# EAGLE design stm_board (EAGLE 9.3.1)
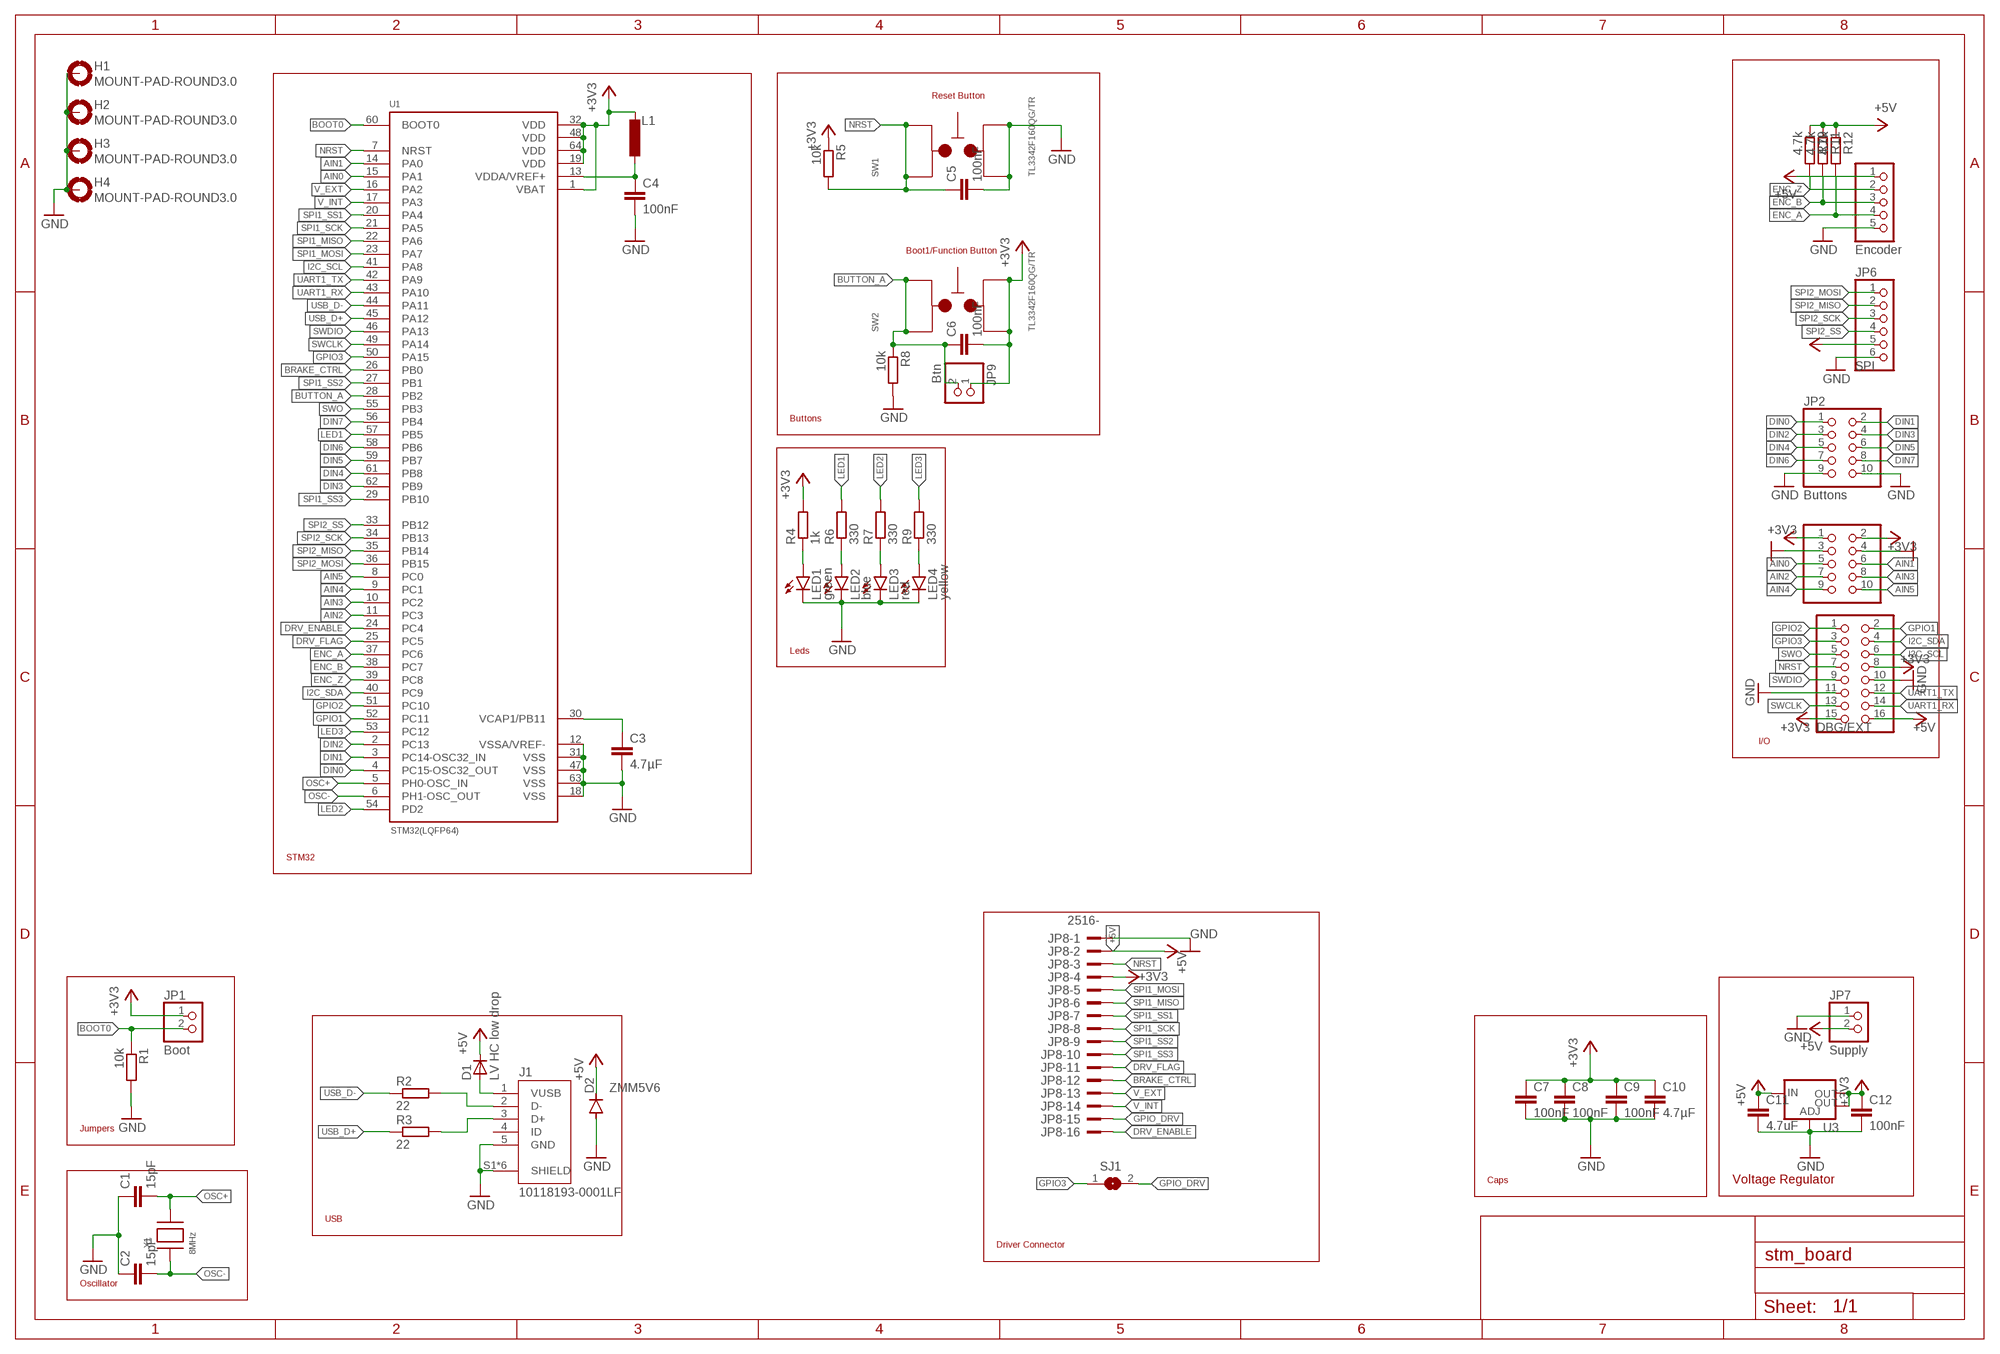
[diagram p0: schematic, sheet 1]

## Parts
C1  15pF  C-EUC0603  [C0603]
C2  15pF  C-EUC0603  [C0603]
C3  4.7µF  C-EUC0805  [C0805]
C4  100nF  C-EUC0603  [C0603]
C5  100nF  C-EUC0603  [C0603]
C6  100nF  C-EUC0603  [C0603]
C7  100nF  C-EUC0603  [C0603]
C8  100nF  C-EUC0603  [C0603]
C9  100nF  C-EUC0603  [C0603]
C10  4.7µF  C-EUC0805  [C0805]
C11  4.7uF  C-EUC0805  [C0805]
C12  100nF  C-EUC0603  [C0603]
D1  LV HC low drop  DIODESMA  [SMADIODE]
D2  ZMM5V6  DIODE-MINIMELF  [MINIMELF]
H1  MOUNT-PAD-ROUND3.0  [3,0-PAD]
H2  MOUNT-PAD-ROUND3.0  [3,0-PAD]
H3  MOUNT-PAD-ROUND3.0  [3,0-PAD]
H4  MOUNT-PAD-ROUND3.0  [3,0-PAD]
J1  10118193-0001LF  [FCI_10118193-0001LF]
JP1  Boot  PINHD-1X2  [1X02]
JP2  Buttons  PINHD-2X5  [2X05]
JP3  Analog  PINHD-2X5  [2X05]
JP4  DBG/EXT  PINHD-2X8  [2X08]
JP5  Encoder  PINHD-1X5  [1X05]
JP6  SPI  PINHD-1X6  [1X06]
JP7  Supply  PINHD-1X2  [1X02]
JP8  2516-  [PAK100/2500-16]
JP9  Btn  PINHD-1X2  [1X02]
L1  2.2µH  L-EUL2012C  [L2012C]
LED1  green  LEDCHIPLED_0805  [CHIPLED_0805]
LED2  blue  LEDCHIPLED_0805  [CHIPLED_0805]
LED3  red  LEDCHIPLED_0805  [CHIPLED_0805]
LED4  yellow  LEDCHIPLED_0805  [CHIPLED_0805]
R1  10k  R-EU_R0603  [R0603]
R2  22  R-EU_R0603  [R0603]
R3  22  R-EU_R0603  [R0603]
R4  1k  R-EU_R0603  [R0603]
R5  10k  R-EU_R0603  [R0603]
R6  330  R-EU_R0603  [R0603]
R7  330  R-EU_R0603  [R0603]
R8  10k  R-EU_R0603  [R0603]
R9  330  R-EU_R0603  [R0603]
R10  4.7k  R-EU_R0603  [R0603]
R11  4.7k  R-EU_R0603  [R0603]
R12  4.7k  R-EU_R0603  [R0603]
SJ1  SJ  [SJ]
SW1  TL3342F160QG/TR  [TL3342F160QG/TR]
SW2  TL3342F160QG/TR  [TL3342F160QG/TR]
U1  STM32(LQFP64)  [QFP50P1200X1200X160-64N]
U3  V_REG_LM1117SOT223  [SOT223]
X1  8MHz  XTALNX5032  [NX5032]

## Nets
+3V3: C6.2 C7.1 C8.1 C9.1 C10.1 C12.1 JP1.1 JP3.1 JP3.2 JP4.8 JP4.15 JP6.5 JP8.4 JP9.1 L1.1 R4.2 R5.1 SW2.1 SW2.2 U1.1(VBAT) U1.19(VDD) U1.32(VDD) U1.48(VDD) U1.64(VDD) U3.2(OUT) U3.4(OUT)
+5V: C11.1 D1.C D2.C JP4.16 JP5.1 JP7.2 JP8.2 R10.1 R11.1 R12.1 U3.3(IN)
AIN0: JP3.5 U1.15(PA1)
AIN1: JP3.6 U1.14(PA0)
AIN2: JP3.7 U1.11(PC3)
AIN3: JP3.8 U1.10(PC2)
AIN4: JP3.9 U1.9(PC1)
AIN5: JP3.10 U1.8(PC0)
BOOT0: JP1.2 R1.1 U1.60(BOOT0)
BRAKE_CTRL: JP8.12 U1.26(PB0)
BUTTON_A: C6.1 JP9.2 R8.1 SW2.3 SW2.4 U1.28(PB2)
DIN0: JP2.1 U1.4(PC15-OSC32_OUT)
DIN1: JP2.2 U1.3(PC14-OSC32_IN)
DIN2: JP2.3 U1.2(PC13)
DIN3: JP2.4 U1.62(PB9)
DIN4: JP2.5 U1.61(PB8)
DIN5: JP2.6 U1.59(PB7)
DIN6: JP2.7 U1.58(PB6)
DIN7: JP2.8 U1.56(PB4)
DRV_ENABLE: JP8.16 U1.24(PC4)
DRV_FLAG: JP8.11 U1.25(PC5)
ENC_A: JP5.4 R12.2 U1.37(PC6)
ENC_B: JP5.3 R11.2 U1.38(PC7)
ENC_Z: JP5.2 R10.2 U1.39(PC8)
GND: C1.1 C2.1 C3.2 C4.2 C5.2 C7.2 C8.2 C9.2 C10.2 C11.2 C12.2 D2.A H1.B3,0(MOUNT) H2.B3,0(MOUNT) H3.B3,0(MOUNT) H4.B3,0(MOUNT) J1.5(GND) J1.S1(SHIELD) J1.S2(SHIELD) J1.S3(SHIELD) J1.S4(SHIELD) J1.S5(SHIELD) J1.S6(SHIELD) JP2.9 JP2.10 JP3.3 JP3.4 JP4.10 JP4.11 JP5.5 JP6.6 JP7.1 JP8.1 LED1.C LED2.C LED3.C LED4.C R1.2 R8.2 SW1.1 SW1.2 U1.12(VSSA/VREF-) U1.18(VSS) U1.31(VSS) U1.47(VSS) U1.63(VSS) U3.1(ADJ)
GPIO1: JP4.2 U1.52(PC11)
GPIO2: JP4.1 U1.51(PC10)
GPIO3: JP4.3 SJ1.1 U1.50(PA15)
GPIO_DRV: JP8.15 SJ1.2
I2C_SCL: JP4.6 U1.41(PA8)
I2C_SDA: JP4.4 U1.40(PC9)
LED1: R6.2 U1.57(PB5)
LED2: R7.2 U1.54(PD2)
LED3: R9.2 U1.53(PC12)
N$1: D1.A J1.1(VUSB)
N$2: LED4.A R9.1
N$3: C4.1 L1.2 U1.13(VDDA/VREF+)
N$4: C3.1 U1.30(VCAP1/PB11)
N$5: J1.2(D-) R2.2
N$6: J1.3(D+) R3.2
N$11: LED1.A R4.1
N$12: LED2.A R6.1
N$13: LED3.A R7.1
NRST: C5.1 JP4.7 JP8.3 R5.2 SW1.3 SW1.4 U1.7(NRST)
OSC+: C1.2 U1.5(PH0-OSC_IN) X1.P$2
OSC-: C2.2 U1.6(PH1-OSC_OUT) X1.P$1
SPI1_MISO: JP8.6 U1.22(PA6)
SPI1_MOSI: JP8.5 U1.23(PA7)
SPI1_SCK: JP8.8 U1.21(PA5)
SPI1_SS1: JP8.7 U1.20(PA4)
SPI1_SS2: JP8.9 U1.27(PB1)
SPI1_SS3: JP8.10 U1.29(PB10)
SPI2_MISO: JP6.2 U1.35(PB14)
SPI2_MOSI: JP6.1 U1.36(PB15)
SPI2_SCK: JP6.3 U1.34(PB13)
SPI2_SS: JP6.4 U1.33(PB12)
SWCLK: JP4.13 U1.49(PA14)
SWDIO: JP4.9 U1.46(PA13)
SWO: JP4.5 U1.55(PB3)
UART1_RX: JP4.14 U1.43(PA10)
UART1_TX: JP4.12 U1.42(PA9)
USB_D+: R3.1 U1.45(PA12)
USB_D-: R2.1 U1.44(PA11)
V_EXT: JP8.13 U1.16(PA2)
V_INT: JP8.14 U1.17(PA3)
Unconnected: J1.4(ID)

## Notes on the sheet
- Reset Button
- Boot1/Function Button
- Buttons
- Leds
- I/O
- STM32
- Jumpers
- Caps | Voltage Regulator
- USB
- Driver Connector
- Oscillator

## Library data of the parts
C1-C12 = resistor:C-EU: CAPACITOR, European symbol
D1 = adafruit:DIODE: Diode SMADIODE - SMA Surface Mount Package 20V 1A Schottky Diode Digikey: 641-1014-6-ND DO-1N4148 - Through Hole Small Current Diode SOD-123 20V 1 A (.5mV Vf) Schottky Diode - Digikey: MBRX120TPMSCT-ND SOD-323 10V 570mA (.38mV Vf, 3ns) Schottky Diode - Digikey: ZLLS410CT-ND SOD-523 30V 30mA Schottky Diode (RB751S-40TE61) - Digikey: RB751S-40TE61CT-ND SOT23-R/W - SOT23 Package (R = Solder Paste/Reflow Ovens, W = Hand-Soldering) BAT54Film 40V 300mA - Digikey: 497-7162-1-ND
D2 = diode:DIODE-: DIODE
H1-H4 = holes:MOUNT-PAD-ROUND: MOUNTING PAD, round
J1 = con_ampusb_10118193-0001LF:10118193-0001LF: Micro USB B Type Receptacle; AVAILABILITY: Unavailable; DESCRIPTION: Single Port 5 Contact Shielded SMT MICRO USB B-Type Receptacle; MF: Amphenol ICC; MP: 10118193-0001LF; PACKAGE: None; PRICE: None
JP1 JP7 JP9 = pinhead:PINHD-1X2: PIN HEADER
JP2 JP3 = pinhead:PINHD-2X5: PIN HEADER
JP4 = pinhead:PINHD-2X8: PIN HEADER
JP5 = pinhead:PINHD-1X5: PIN HEADER
JP6 = pinhead:PINHD-1X6: PIN HEADER
JP8 = con-3m:2516-: 3M (TM) Pak 100 4-Wall Header Source: 3M; OC_FARNELL: unknown; OC_NEWARK: unknown
L1 = resistor:L-EU: INDUCTOR, European symbol
LED1-LED4 = led:LED: LED OSRAM: - CHIPLED LG R971, LG N971, LY N971, LG Q971, LY Q971, LO R971, LY R971 LH N974, LH R974 LS Q976, LO Q976, LY Q976 LO Q996 - Hyper CHIPLED LW Q18S LB Q993, LB Q99A, LB R99A - SideLED LS A670, LO A670, LY A670, LG A670, LP A670 LB A673, LV A673, LT A673, LW A673 LH A674 LY A675 LS A676, LA A676, LO A676, LY A676, LW A676 LS A679, LY A679, LG A679 - Hyper Micro SIDELED® LS Y876, LA Y876, LO Y876, LY Y876 LT Y87S - SmartLED LW L88C, LW L88S LB L89C, LB L89S, LG L890 LS L89K, LO L89K, LY L89K LS L896, LA L896, LO L896, LY L896 - TOPLED LS T670, LO T670, LY T670, LG T670, LP T670 LSG T670, LSP T670, LSY T670, LOP T670, LYG T670 LG T671, LOG T671, LSG T671 LB T673, LV T673, LT T673, LW T673 LH T674 LS T676, LA T676, LO T676, LY T676, LB T676, LH T676, LSB T676, LW T676 LB T67C, LV T67C, LT T67C, LS T67K, LO T67K, LY T67K, LW E67C LS E67B, LA E67B, LO E67B, LY E67B, LB E67C, LV E67C, LT E67C LW T67C LS T679, LY T679, LG T679 LS T770, LO T770, LY T770, LG T770, LP T770 LB T773, LV T773, LT T773, LW T773 LH T774 LS E675, LA E675, LY E675, LS T675 LS T776, LA T776, LO T776, LY T776, LB T776 LHGB T686 LT T68C, LB T68C - Hyper Mini TOPLED® LB M676 - Mini TOPLED Santana® LG M470 LS M47K, LO M47K, LY M47K Source: http://www.osram.convergy.de LUXEON: - LUMILED® LXK2-PW12-R00, LXK2-PW12-S00, LXK2-PW14-U00, LXK2-PW14-V00 LXK2-PM12-R00, LXK2-PM12-S00, LXK2-PM14-U00 LXK2-PE12-Q00, LXK2-PE12-R00, LXK2-PE12-S00, LXK2-PE14-T00, LXK2-PE14-U00 LXK2-PB12-K00, LXK2-PB12-L00, LXK2-PB12-M00, LXK2-PB14-N00, LXK2-PB14-P00, LXK2-PB14-Q00 LXK2-PR12-L00, LXK2-PR12-M00, LXK2-PR14-Q00, LXK2-PR14-R00 LXK2-PD12-Q00, LXK2-PD12-R00, LXK2-PD12-S00 LXK2-PH12-R00, LXK2-PH12-S00 LXK2-PL12-P00, LXK2-PL12-Q00, LXK2-PL12-R00 Source: www.luxeon.com KINGBRIGHT: KA-3528ASYC Source: www.kingbright.com
R1-R12 = resistor:R-EU_: RESISTOR, European symbol
SJ1 = jumper:SJ: SMD solder JUMPER
SW1 SW2 = Switch:TL3342F160QG/TR: SWITCH TACTILE SPST-NO 0.05A 12V Manufacturer's datasheet <http://spec_sheets.e-switch.com/specs/P010632.pdf>; CREATED_BY: PCBLayout.com; DIGI_KEY_PART_NUMBER: EG2531CT-ND; MANUFACTURER: E-Switch; MPN: TL3342F160QG/TR; PACKAGE: SPST_NO
U1 = STM32F411RET6:STM32(LQFP64); AVAILABILITY: Unavailable; MF: STMicroelectronics; MP: STM32; PACKAGE: LQFP-64 STMicroelectronics; PRICE: None
U3 = SparkFun-IC-Power:V_REG_LM1117: Voltage Regulator LM1117 Standard adjustable voltage regulator but in SMD form. Spark Fun Electronics SKU : COM-00595; PROD_ID: VREG-08170
X1 = adafruit:XTAL: Low cost SMT crystals, no capacitors included http://www.ladyada.net/library/eagle

## Board
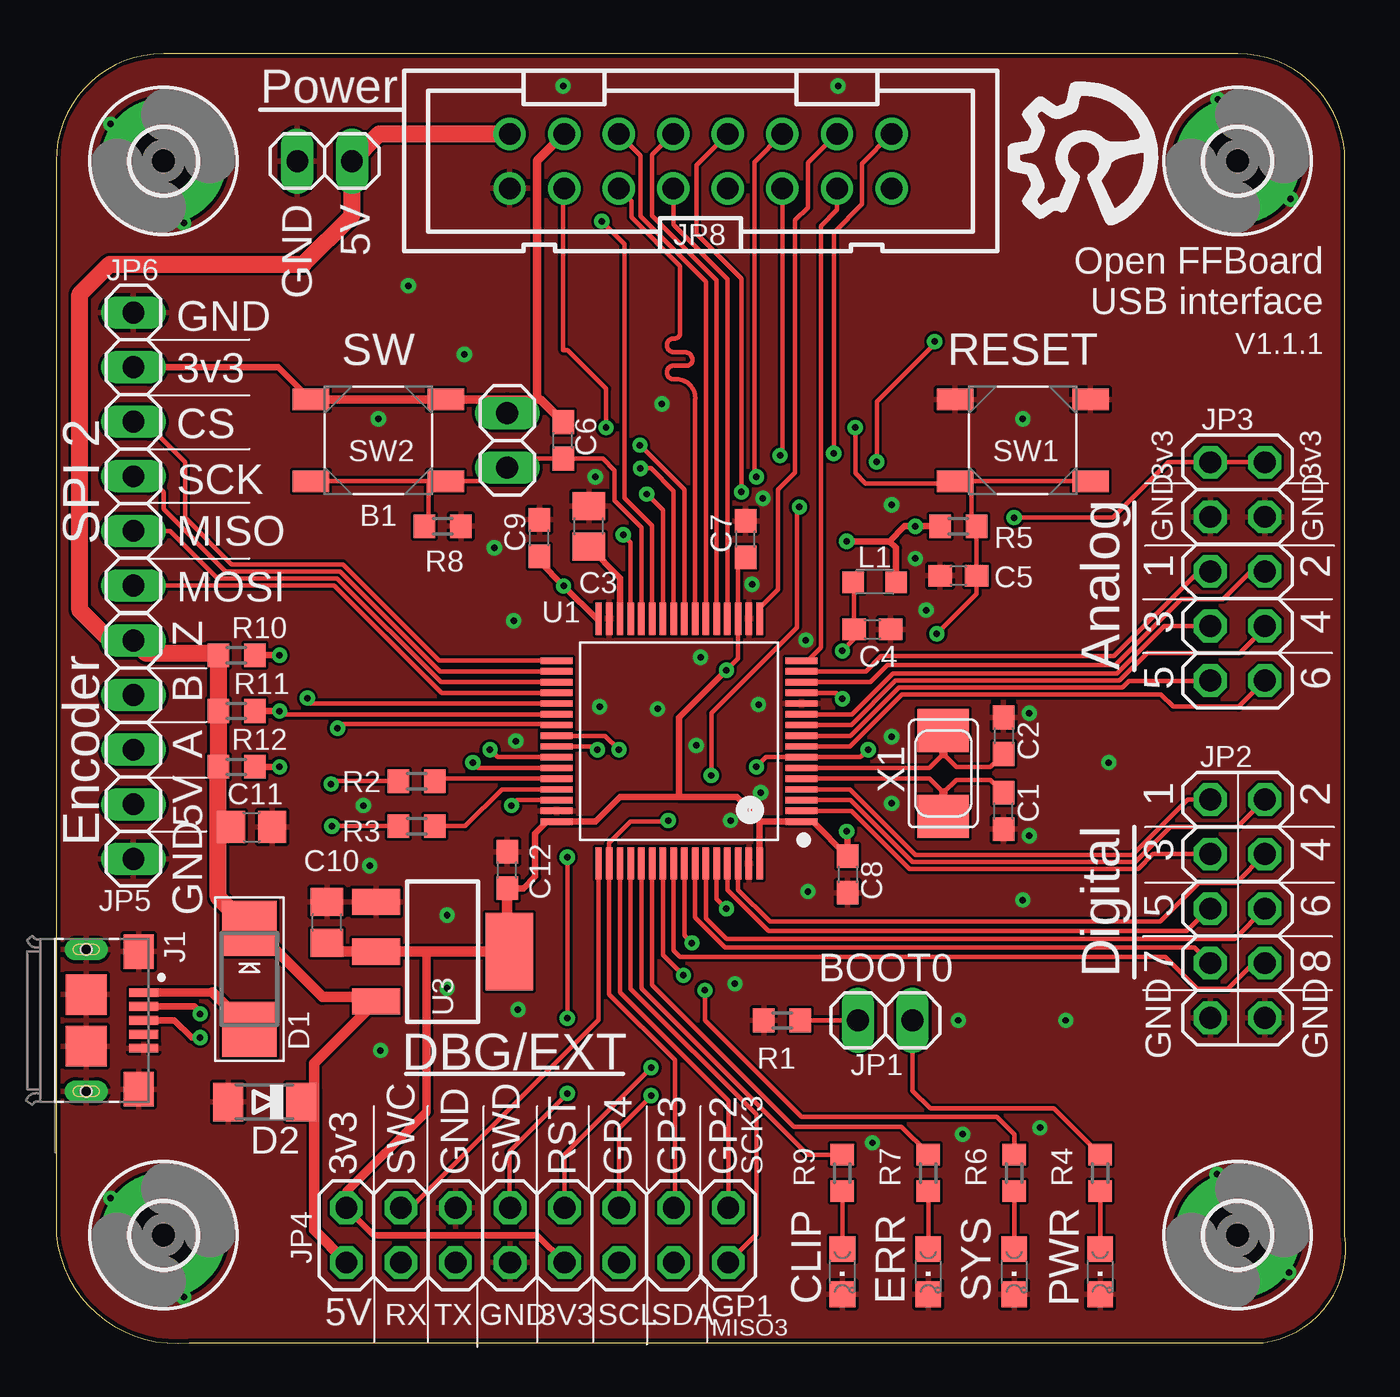
[diagram p1: board, top side]
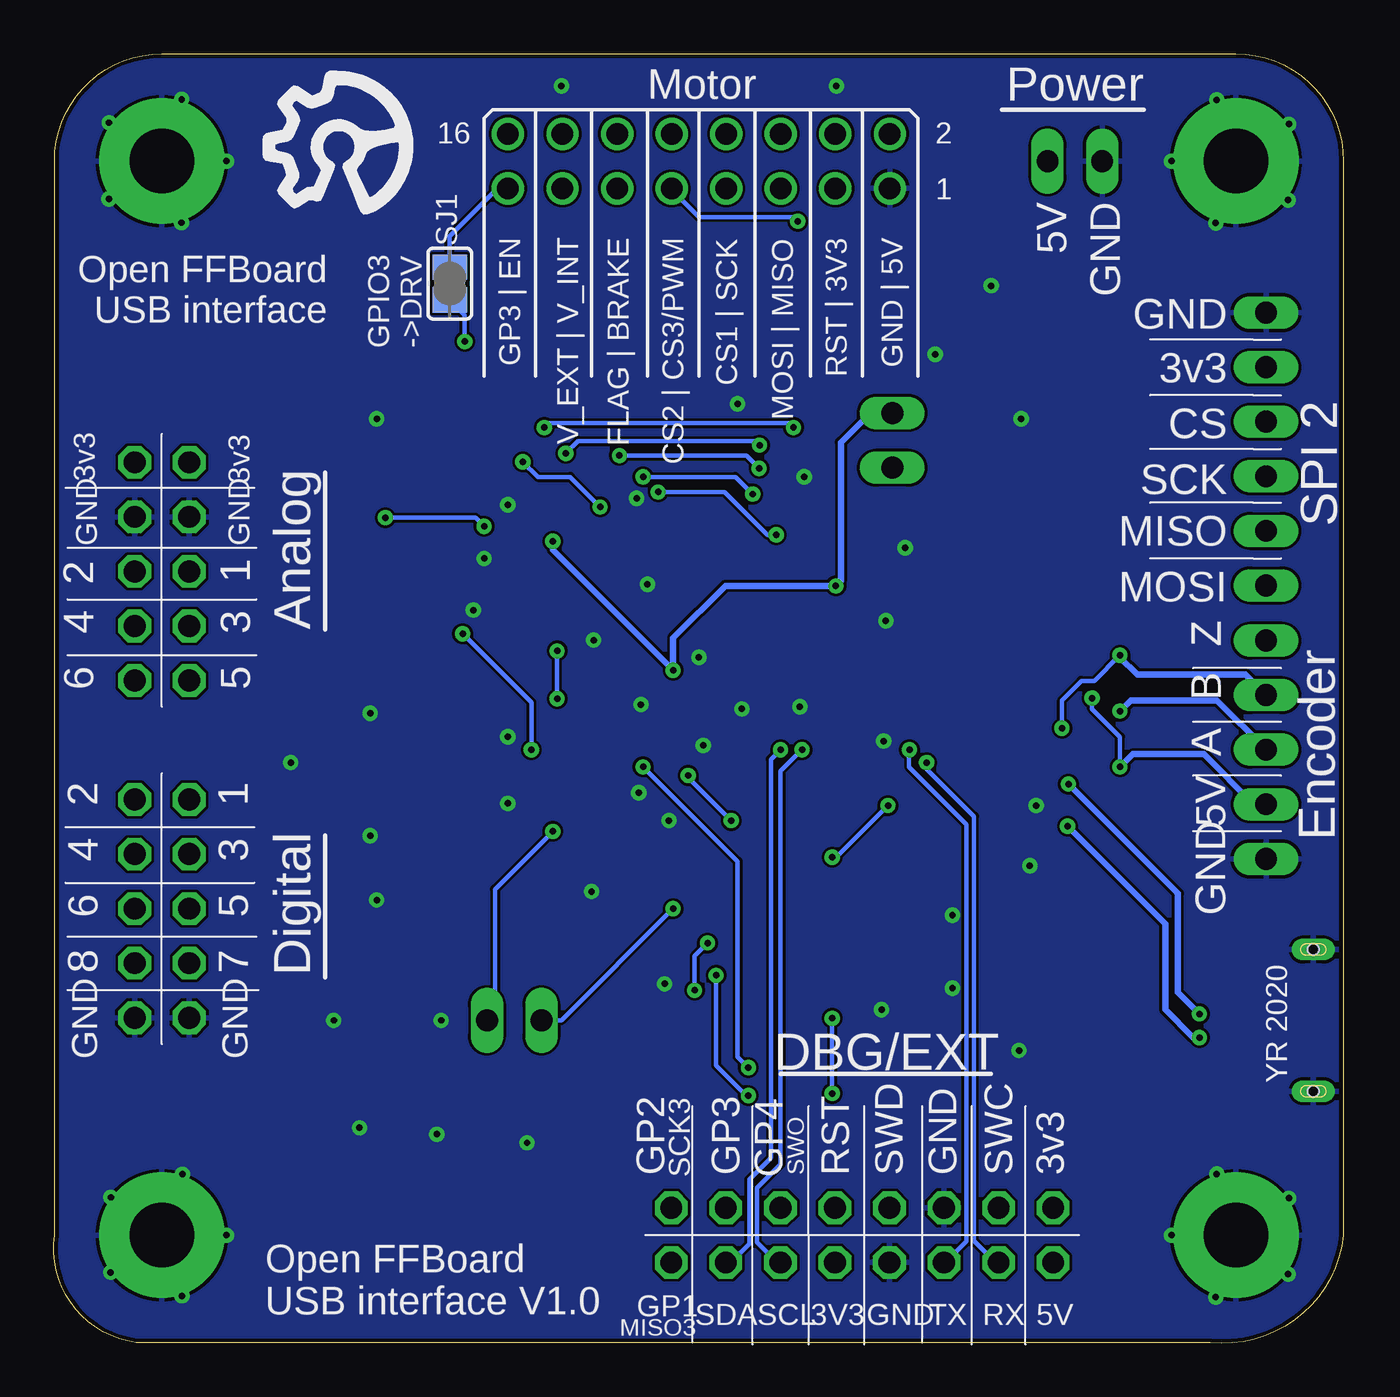
[diagram p2: board, bottom side, seen from below]

Size 60.04 x 60.03 mm. Coordinates in mm from the lower left corner, seen from the top.
Outline: 6.2,0.03 56.2,0.03 arc90 60,5.03 60,55.03 arc90 55,60.03 5,60.03 arc90 0,55.03 0,5.03 arc90 6.2,0.03
Copper layers (1*16): Top 0.035mm / dielectric 1.5mm / Bottom 0.035mm
Design rules "jlcpcb *": minimum track width 5mil, minimum drill 0.3mm, track to track 5mil, track to pad 5mil, pad to pad 5mil, via to via 5mil, smd to smd 5mil, copper to edge 0.2mm, drill to drill 8mil, minimum pad ring 10mil, minimum via ring 8mil, stop-mask expansion 2mil, vias tented up to drill 0mil, thermal gap 6mil

### Footprints (pad centres in the part's own frame; a part is rotated, then mirrored left to right if it is on the bottom)
C0603 = smd 1.1 x 1: 1 -0.85,0; 2 0.85,0
C0805 = smd 1.3 x 1.5: 1 -0.95,0; 2 0.95,0
SMADIODE = smd 2.54 x 2.54: A 2.349,0; C -2.349,0
MINIMELF = smd 1.4 x 1.8: A 1.7,0; C -1.7,0
3,0-PAD = drill 3 pad 5.842: B3,0 0,0
FCI_10118193-0001LF = smd 0.4 x 1.35: 1 -1.3,2.675; 2 -0.65,2.675; 3 0,2.675; 4 0.65,2.675; 5 1.3,2.675 | smd 1.6 x 1.4: S1 -3.2,2.45; S2 3.2,2.45 | smd 1.9 x 1.9: S3 1.2,0; S4 -1.2,0 | drill 0.5 pad 0.9 long: S5 -3.3,0; S6 3.3,0 | hole 0.5: -3.3,0; 3.3,0
1X02 = drill 1.016 long: 1 -1.27,0; 2 1.27,0
2X05 = drill 1.016 octagon: 1 -5.08,-1.27; 2 -5.08,1.27; 3 -2.54,-1.27; 4 -2.54,1.27; 5 0,-1.27; 6 0,1.27; 7 2.54,-1.27; 8 2.54,1.27; 9 5.08,-1.27; 10 5.08,1.27
2X08 = drill 1.016 octagon: 1 -8.89,-1.27; 2 -8.89,1.27; 3 -6.35,-1.27; 4 -6.35,1.27; 5 -3.81,-1.27; 6 -3.81,1.27; 7 -1.27,-1.27; 8 -1.27,1.27; 9 1.27,-1.27; 10 1.27,1.27; 11 3.81,-1.27; 12 3.81,1.27; 13 6.35,-1.27; 14 6.35,1.27; 15 8.89,-1.27; 16 8.89,1.27
1X05 = drill 1.016 long: 1 -5.08,0; 2 -2.54,0; 3 0,0; 4 2.54,0; 5 5.08,0
1X06 = drill 1.016 long: 1 -6.35,0; 2 -3.81,0; 3 -1.27,0; 4 1.27,0; 5 3.81,0; 6 6.35,0
PAK100/2500-16 = drill 1 pad 1.422: 1 -8.89,-1.27; 2 -8.89,1.27; 3 -6.35,-1.27; 4 -6.35,1.27; 5 -3.81,-1.27; 6 -3.81,1.27; 7 -1.27,-1.27; 8 -1.27,1.27; 9 1.27,-1.27; 10 1.27,1.27; 11 3.81,-1.27; 12 3.81,1.27; 13 6.35,-1.27; 14 6.35,1.27; 15 8.89,-1.27; 16 8.89,1.27
L2012C = smd 1 x 1: 1 -1,0; 2 1,0
CHIPLED_0805 = smd 1.2 x 1.2: A 0,-1.05; C 0,1.05
R0603 = smd 1 x 1.1: 1 -0.85,0; 2 0.85,0
SJ = smd 1.168 x 1.6: 1 -0.762,0; 2 0.762,0
TL3342F160QG/TR = smd 1.7 x 1: 1 -3.15,-1.9; 2 3.15,-1.9; 3 -3.15,1.9; 4 3.15,1.9
QFP50P1200X1200X160-64N = smd 1.5 x 0.3: 1 -5.7,3.75; 2 -5.7,3.25; 3 -5.7,2.75; 4 -5.7,2.25; 5 -5.7,1.75; 6 -5.7,1.25; 7 -5.7,0.75; 8 -5.7,0.25; 9 -5.7,-0.25; 10 -5.7,-0.75; 11 -5.7,-1.25; 12 -5.7,-1.75; 13 -5.7,-2.25; 14 -5.7,-2.75; 15 -5.7,-3.25; 16 -5.7,-3.75; 33 5.7,-3.75; 34 5.7,-3.25; 35 5.7,-2.75; 36 5.7,-2.25; 37 5.7,-1.75; 38 5.7,-1.25; 39 5.7,-0.75; 40 5.7,-0.25; 41 5.7,0.25; 42 5.7,0.75; 43 5.7,1.25; 44 5.7,1.75; 45 5.7,2.25; 46 5.7,2.75; 47 5.7,3.25; 48 5.7,3.75 | smd 0.3 x 1.5: 17 -3.75,-5.7; 18 -3.25,-5.7; 19 -2.75,-5.7; 20 -2.25,-5.7; 21 -1.75,-5.7; 22 -1.25,-5.7; 23 -0.75,-5.7; 24 -0.25,-5.7; 25 0.25,-5.7; 26 0.75,-5.7; 27 1.25,-5.7; 28 1.75,-5.7; 29 2.25,-5.7; 30 2.75,-5.7; 31 3.25,-5.7; 32 3.75,-5.7; 49 3.75,5.7; 50 3.25,5.7; 51 2.75,5.7; 52 2.25,5.7; 53 1.75,5.7; 54 1.25,5.7; 55 0.75,5.7; 56 0.25,5.7; 57 -0.25,5.7; 58 -0.75,5.7; 59 -1.25,5.7; 60 -1.75,5.7; 61 -2.25,5.7; 62 -2.75,5.7; 63 -3.25,5.7; 64 -3.75,5.7
SOT223 = smd 1.219 x 2.235: 1 -2.311,-3.099; 2 0,-3.099; 3 2.311,-3.099 | smd 3.6 x 2.2: 4 0,3.099
NX5032 = smd 2 x 2.4: P$1 2,0; P$2 -2,0

### Placement (x,y rotation side)
C1  44.1,24.78 90 top
C2  44.1,28.28 270 top
C3  24.8,38.03 90 top
C4  38,33.23 0 top
C5  42,35.73 180 top
C6  23.6,42.03 90 top
C7  32.1,37.43 90 top
C8  36.84,21.82 270 top
C9  22.5,37.49 90 top
C10  12.61,19.59 90 top
C11  9.1,24.03 0 top
C12  21,22.03 90 top
D1  9,16.96 270 top
D2  9.7,11.23 180 top
H1  55,5.03 0 top
H2  5,5.03 0 top
H3  55,55.03 0 top
H4  5,55.03 0 top
J1  1.4,15.03 270 top
JP1  38.6,15.03 180 top
JP2  55,20.23 270 top
JP3  55,35.93 270 top
JP4  22.4,5.03 180 top
JP5  3.6,27.63 270 top
JP6  3.6,41.63 90 top
JP7  12.5,55.03 0 top
JP8  30,55.03 0 top
JP9  21,42.03 270 top
L1  38.1,35.43 180 top
LED1  48.6,3.33 180 top
LED2  44.6,3.33 180 top
LED3  40.6,3.33 180 top
LED4  36.6,3.33 180 top
R1  33.8,15.03 180 top
R2  16.79,26.17 180 top
R3  16.79,24.07 180 top
R4  48.6,7.93 90 top
R5  42,38.03 0 top
R6  44.6,7.93 90 top
R7  40.6,7.93 90 top
R8  18,38.03 0 top
R9  36.6,7.93 90 top
R10  8.4,32.03 0 top
R11  8.4,29.43 0 top
R12  8.4,26.83 0 top
SJ1  41.6,49.33 90 bottom
SW1  45,42.03 180 top
SW2  15,42.03 180 top
U1  29,28.03 180 top
U3  18,18.23 270 top
X1  41.3,26.53 90 top

### Tracks (layer width: path | path; a pad name or v marks a point on that pad's centre or on a via)
+3V3  (via drill 0.3)
  Top 0.2: C6.2 23.6,43.23 | v31.2,31.33 31.75,31.88 U1.19 31.75,36.23 C7.1 | R4.2 46.45,10.93 40.7,10.93 39.87,11.76 JP1.1 | JP3.2 JP3.1 51.78,41.01 49.2,38.43 v44.6,38.43
  Top 0.3: 29,25.43 26.25,25.43 25.1,24.28 U1.48 22.85,24.28 22.3,23.73 22.3,21.73 21.75,21.18 C12.1 | 29,25.43 29,29.13 v31.2,31.33 | U1.32 25.2,33.68 v23.62,35.26 22.5,36.38 C9.1 | 38.8,37.33 39.5,38.03 v40,38.03 R5.1 | 38.8,37.33 v36.8,37.33 | L1.1 39.1,37.03 38.8,37.33 | 32.75,24.28 U1.1 35.23,24.28 C8.1 36.84,23.79 v36.8,23.83 | 29,25.43 31.7,25.43 32.75,24.38 32.75,24.28 | JP4.8 22.4,5.03 14.78,5.03 JP4.15 | U1.64 32.75,24.28 | JP9.1 21,43.93 | JP6.5 10.34,45.44 SW2.2
  Top 0.4: SW2.2 SW2.1 21,43.93 22.4,43.93 | 22.4,43.93 22.55,43.93 C6.2 | JP8.4 22.4,55.05 22.4,43.93 | JP4.15 13.51,7.04 17.25,10.78 17.25,18.23 16.25,18.23 16,18.23
  Top 0.5: C10.1 13.02,18.23 U3.2 16.25,18.23 | 16,18.23 U3.4 21,18.33 C12.1
  Bottom 0.2: v36.8,23.83 39.5,21.13 39.5,15.4 JP1.1 | v44.6,38.43 40.4,38.43 v40,38.03
  Bottom 0.3: v36.8,37.33 36.8,36.93 v31.2,31.33 31.2,32.83 28.77,35.26 v23.62,35.26 23.4,35.48 23.4,41.93 22,43.33 21.03,43.33 JP9.1
+5V
  Top 0.4: D2.C 12.01,11.84
  Top 0.5: R12.1 7.5,26.83 7.46,26.79 | 7.47,32.11 R10.1 | JP4.16 12,5.27 12.01,5.28 12.01,11.84 12.01,13.03 U3.3 14.71,16.11 12.4,16.11 9.98,18.54 9.98,19.31 D1.C | C11.1 7.55,24.03
  Top 0.8: R10.1 R11.1 R12.1 7.55,24.03 7.55,20.76 D1.C | 7.47,32.11 4.2,32.11 JP5.1 2.52,32.71 1.1,34.13 1.1,48.83 2.5,50.23 11.5,50.23 13.77,52.5 JP7.2 15.04,56.3 JP8.2
AIN0
  Top 0.2: U1.15 37.7,31.28 38.4,31.98 49.25,31.98 53.2,35.93 JP3.5
AIN1
  Top 0.2: U1.14 37.9,30.78 38.7,31.58 49.31,31.58 52.38,34.65 54.34,34.65 55.62,35.93 JP3.6
AIN2
  Top 0.2: U1.11 37.05,29.28 38.95,31.18 49.37,31.18 51.59,33.39 JP3.7
AIN3
  Top 0.2: U1.10 37.01,28.78 39.08,30.85 49.51,30.85 50.79,32.13 55.11,32.13 56.27,33.29 JP3.8
AIN4
  Top 0.2: U1.9 36.99,28.28 39.23,30.52 49.64,30.52 49.94,30.82 53.7,30.82 JP3.9
AIN5
  Top 0.2: U1.8 36.95,27.78 39.37,30.2 51.44,30.2 52,29.63 55.05,29.63 JP3.10
BOOT0  (via drill 0.3)
  Top 0.2: U1.60 30.75,20.68 v31.2,20.23 | JP1.2 R1.1
  Bottom 0.2: v31.2,20.23 36.4,15.03 JP1.2
BRAKE_CTRL  (via drill 0.3)
  Top 0.2: v27.5,39.53 28.25,38.78 U1.26 | JP8.12 32.5,54.99 32.5,40.43 v32.6,40.33
  Bottom 0.2: v27.5,39.53 28.3,40.33 v32.6,40.33
BUTTON_A
  Top 0.2: U1.28 27.25,37.98 26,39.23 26,40.63 25.45,41.18 C6.1 20.95,41.18 19.9,40.13 SW2.3 | SW2.3 17.35,40.13 17.35,38.23 R8.1 | SW2.3 SW2.4
  Top 0.3: JP9.2 21,41.13 20.95,41.18
DIN0
  Top 0.2: U1.4 36.95,25.78 40,22.73 50.1,22.73 52.68,25.31 JP2.1
DIN1
  Top 0.2: U1.3 36.99,25.28 39.87,22.4 50.23,22.4 51.86,24.03 54.99,24.03 JP2.2
DIN2
  Top 0.2: U1.2 37.02,24.78 39.73,22.08 50.37,22.08 51.06,22.77 JP2.3
DIN3
  Top 0.2: U1.62 31.75,21.11 33.23,19.63 51.4,19.63 53.2,21.43 54.93,21.43 JP2.4
DIN4
  Top 0.2: U1.61 31.25,21.11 33.16,19.2 52.63,19.2 53.66,20.23 JP2.5
DIN5
  Top 0.2: JP2.6 54.87,18.83 31.2,18.83 30.25,19.78 U1.59
DIN6
  Top 0.2: U1.58 29.75,19.82 31.14,18.43 52.99,18.43 JP2.7
DIN7
  Top 0.2: JP2.8 55.73,17.69 54.54,16.5 53.12,16.5 51.63,17.99 29.04,17.99 28.75,18.28 U1.56
DRV_ENABLE  (via drill 0.3)
  Top 0.2: v36.2,41.43 36.2,51.71 37.51,53.02 37.51,54.92 JP8.16 | U1.24 29.25,39.73 v27.18,41.81
  Bottom 0.2: v27.18,41.81 27.38,42.01 35.62,42.01 v36.2,41.43
DRV_FLAG  (via drill 0.3)
  Top 0.2: v27.2,40.73 27.7,40.73 28.75,39.68 U1.25 | JP8.11 33.8,41.43 v33.7,41.33
  Bottom 0.2: v33.7,41.33 27.8,41.33 v27.2,40.73
ENC_A  (via drill 0.3)
  Top 0.2: v11.7,30.03 11.7,29.83 11.75,29.78 U1.37
  Top 0.3: v10.4,26.83 R12.2
  Bottom 0.2: v10.4,26.83 10.4,28.23 11.7,29.53 v11.7,30.03
  Bottom 0.3: JP5.4 4.16,25.09 6.5,27.43 9.8,27.43 v10.4,26.83
ENC_B  (via drill 0.3)
  Top 0.2: U1.38 10.55,29.28 v10.4,29.43
  Top 0.3: v10.4,29.43 R11.2
  Bottom 0.3: JP5.3 5.9,29.93 9.9,29.93 v10.4,29.43
ENC_Z  (via drill 0.3)
  Top 0.2: U1.39 23.25,28.83 13.3,28.83 v13.1,28.63
  Top 0.3: v10.4,32.03 R10.2
  Bottom 0.2: v13.1,28.63 13.1,29.93 12.2,30.83 11.6,30.83 v10.4,32.03
  Bottom 0.3: JP5.2 4.56,31.13 9.6,31.13 10.4,31.93 v10.4,32.03
GND  (via drill 0.3)
  other vias: 45,43.03 15,43.03 28,29.53 29.8,27.83 32.8,25.63 25.3,29.63 38,9.33 42.2,9.73 42,15.03 47,15.03 18.2,19.93 18.2,16.53 19,46.03 16.4,49.23 23.6,58.53 36.4,58.53 35,21.03 45,20.63 38.9,28.23 38.9,25.13 14.6,22.23 15.1,13.63 40,36.53 38.9,39.03 32.4,35.33 28.2,43.73 21.4,28.03 20.4,37.03 25.1,40.33 34.9,32.73 32.7,29.73 32.9,39.33 14.3,25.03 45.3,29.33 45.3,23.63 52,5.03 54.05,7.87 57.38,6.8 57.39,3.3 54.06,2.21 52,55.03 54.08,57.91 57.45,56.82 57.46,53.27 54.09,52.17 8,55.03 5.94,52.15 2.57,53.21 2.54,56.75 5.89,57.88 8,5.03 5.94,2.15 2.57,3.21 2.54,6.75 5.89,7.88 31.6,16.73 30,31.93 31.4,24.33 45.8,10.03 21.3,33.63 21.5,15.53 49,27.03 40.5,34.13
  pour Top: -1,61.03 -1,-0.97 61,-0.97 61,61.03
  pour Bottom: -2,61.03 -2,-0.97 60,-0.97 60,61.03
GPIO1
  Top 0.2: U1.52 26.75,16.5 32.6,10.65 32.6,5.07 JP4.2
GPIO2
  Top 0.2: U1.51 26.25,16.33 31.29,11.29 JP4.1
GPIO3  (via drill 0.3)
  Top 0.2: v28.5,24.33 28.45,24.28 26.75,24.28 25.75,23.28 U1.50 25.75,16.23 28.8,13.18 28.8,6.35 JP4.3 | v38.2,41.03 38.2,43.83 40.9,46.53 v40.9,46.63 | v30.5,26.43 30.5,29.33 34.48,33.31 34.48,38.81 v34.6,38.93
  Bottom 0.2: v40.9,46.63 40.9,47.87 SJ1.1 | v30.5,26.43 30.5,26.33 v28.5,24.33 | v38.2,41.03 37.5,40.33 36,40.33 v34.6,38.93
GPIO_DRV
  Bottom 0.2: SJ1.2 41.6,51.53 39.37,53.76 JP8.15
I2C_SCL  (via drill 0.3)
  Top 0.2: U1.41 25.05,27.78 v25.2,27.63
  Bottom 0.2: v25.2,27.63 26.2,26.63 26.2,8.33 27.3,7.23 27.3,4.7 26.36,3.76 JP4.6
I2C_SDA  (via drill 0.3)
  Top 0.2: v26.2,27.63 25.55,28.28 U1.40
  Bottom 0.2: v26.2,27.63 26.65,27.18 26.65,8.63 27.65,7.63 27.65,4.64 28.53,3.76 JP4.4
LED1  (via drill 0.3)
  Top 0.2: R6.2 44.6,9.73 43.8,10.53 34.7,10.53 30.2,15.03 v30.2,16.43 | U1.57 29.25,18.98 v29.6,18.63
  Bottom 0.2: v29.6,18.63 30.2,18.03 v30.2,16.43
LED2
  Top 0.2: R7.2 40.6,8.83 39.35,10.08 34.35,10.08 27.75,16.68 U1.54
LED3
  Top 0.2: U1.53 27.25,16.53 35,8.78 R9.2
N$1
  Top 0.406: 7.28,16.33 J1.1
  Top 0.5: D1.A 7.28,16.33
N$2
  Top 0.2: R9.1 LED4.A
N$3  (via drill 0.3)
  Top 0.2: v36.6,30 36.32,30.28 U1.13 | v36.6,32.23 37.15,32.78 C4.1 37.15,35.38 L1.2
  Bottom 0.2: v36.6,30 v36.6,32.23
N$4
  Top 0.3: C3.1 26.25,35.63 U1.30
N$5  (via drill 0.3)
  Top 0.2: v12.8,26.03 12.94,26.17 R2.2
  Top 0.3: J1.2 6.45,15.68 6.7,15.43 v6.7,15.33
  Bottom 0.3: v6.7,15.33 7.7,16.33 7.7,20.93 v12.8,26.03
N$6  (via drill 0.3)
  Top 0.2: R3.2 v12.84,24.07
  Top 0.3: v6.7,14.23 6.3,14.23 5.5,15.03 J1.3
  Bottom 0.3: v6.7,14.23 7,14.23 8.3,15.53 8.3,19.53 v12.84,24.07
N$11
  Top 0.2: R4.1 LED1.A
N$12
  Top 0.2: R6.1 LED2.A
N$13
  Top 0.2: R7.1 LED3.A
NRST  (via drill 0.3)
  Top 0.2: v37.8,27.63 37.45,27.28 U1.7 33.05,27.28 v32.6,26.83 | 42.6,40.13 SW1.4 41.75,40.03 37.68,40.03 37.2,40.51 v37.2,42.63 | 42.6,40.13 SW1.3 | v25.6,42.63 25.6,44.43 23.8,46.23 23.6,46.23 23.6,53.71 JP8.3 | 42.6,40.13 42.6,38.28 R5.2 42.85,36.03 42.85,34.88 v41,33.03 | v27.7,12.83 23.67,8.8 JP4.7
  Top 0.3: C5.1 42.85,36.03
  Bottom 0.2: v37.8,27.63 37.8,29.83 v41,33.03 | v32.6,26.83 28.2,22.43 28.2,13.33 v27.7,12.83 | v37.2,42.63 37,42.83 25.8,42.83 v25.6,42.63
OSC+
  Top 0.2: C1.2 43.5,26.23 41.9,26.23 41.3,25.63 40.65,26.28 U1.5
  Top 0.4: X1.P$2 41.3,25.63
OSC-
  Top 0.2: U1.6 40.65,26.78 41.3,27.43 41.9,26.83 43.5,26.83 C2.2
  Top 0.4: X1.P$1 41.3,27.43
SPI1_MISO
  Top 0.2: U1.22 30.25,49.41 27.2,52.46 27.2,55.29 JP8.6
SPI1_MOSI
  Top 0.2: JP8.5 26.79,53.16 26.79,52.41 29.05,50.15 29.05,47.03 arc-90 28.79,46.77 28.75,46.77 arc90 28.43,46.46 arc90 28.75,46.14 29.25,46.14 arc-90 29.62,45.78 arc-90 29.36,45.51 28.75,45.51 arc90 28.43,45.2 arc90 28.75,44.88 28.79,44.88 arc-100 29.75,43.92 U1.23
SPI1_SCK
  Top 0.2: U1.21 30.75,49.48 27.75,52.48 27.75,55.32 JP8.8
SPI1_SS1
  Top 0.2: JP8.7 28.73,52.06 31.25,49.54 U1.20
SPI1_SS2  (via drill 0.3)
  Top 0.2: U1.27 27.75,38.06 26.46,39.35 26.46,51.17 v25.4,52.23
  Bottom 0.2: v25.4,52.23 25.6,52.43 30,52.43 31.27,53.7 JP8.9
SPI1_SS3  (via drill 0.3)
  Top 0.2: U1.29 26.75,37.28 v26.4,37.63 | v31.9,39.63 31.9,49.56 29.8,51.66 29.8,54.83 JP8.10
  Bottom 0.2: v31.9,39.63 28.8,39.63 26.8,37.63 v26.4,37.63
SPI2_MISO
  Top 0.2: U1.35 17.91,30.78 13.09,35.61 7.51,35.61 5.3,37.82 JP6.2
SPI2_MOSI
  Top 0.2: JP6.1 12.95,35.28 17.95,30.28 U1.36
SPI2_SCK
  Top 0.2: U1.34 17.88,31.28 13.22,35.94 7.9,35.94 5,38.83 5,39.63 4.27,40.36 JP6.3
SPI2_SS
  Top 0.2: U1.33 17.84,31.78 13.36,36.26 8.17,36.26 6,38.43 6,41.03 4.13,42.9 JP6.4
SWCLK
  Top 0.2: U1.49 25.25,15.05 16.5,6.3 JP4.13
SWDIO  (via drill 0.3)
  Top 0.2: U1.46 21.45,25.28 v21.2,25.03 | v23.8,22.63 v23.8,15.13 | JP4.9 21.1,6.33 21.1,8.93 v23.8,11.63
  Bottom 0.2: v23.8,15.13 v23.8,11.63 | v21.2,25.03 23.6,22.63 v23.8,22.63
SWO  (via drill 0.3)
  Top 0.2: U1.55 28.25,18.08 v29.2,17.13 | JP4.5 26.21,10 27.7,11.49 v27.7,11.53
  Bottom 0.2: v29.2,17.13 29.2,12.93 27.8,11.53 v27.7,11.53
UART1_RX  (via drill 0.3)
  Top 0.2: U1.43 19.65,26.78 v19.4,27.03
  Bottom 0.2: v19.4,27.03 19.4,26.73 17.2,24.53 17.2,4.77 16.19,3.76 JP4.14
UART1_TX  (via drill 0.3)
  Top 0.2: U1.42 20.55,27.28 v20.2,27.63
  Bottom 0.2: v20.2,27.63 20.21,27.62 20.21,26.83 17.54,24.16 17.54,4.75 18.53,3.76 JP4.12
USB_D+
  Top 0.2: U1.45 20.75,25.78 19.04,24.07 R3.1
USB_D-
  Top 0.2: U1.44 17.64,26.28 R2.1
V_EXT
  Top 0.2: U1.16 35,31.78 35.6,32.38 35.6,52.01 36.35,52.76 JP8.13
V_INT
  Top 0.2: U1.17 32.75,34.23 33.6,35.08 33.6,39.73 34.4,40.53 34.4,52.27 35,52.87 35,54.95 JP8.14

### Text on the board
tPlace: Power | GND | 5V | Open FFBoard / USB interface | GND | V1.1.1 | SW | RESET | 3v3 | SPI 2 | CS | SCK | 3v3 | 3v3 | B1 | MISO | GND | GND | 1 | 2 | MOSI | 3 | 4 | Encoder | Z | Analog | B | 5 | 6 | A | 1 | 2 | 5V | 3 | 4 | GND | 5 | 6 | BOOT0 | Digital | 7 | 8 | DBG/EXT | GND | GND | 3v3 | SWC | GND | SWD | RST | GP4 | GP3 | GP2 | SCK3 | CLIP | ERR | SYS | PWR | 5V | RX | TX | GND | 3V3 | SCL | SDA | GP1 | MISO3
bPlace: Power | Motor | 2 | 16 | GND | 5V | 1 | GND | 5V | RST | 3V3 | MOSI | MISO | CS1 | SCK | CS2 | CS3/PWM | FLAG | BRAKE | V_EXT | V_INT | GP3 | EN | Open FFBoard / USB interface | GND | 3v3 | GPIO3 / ->DRV | CS | SCK | 3v3 | 3v3 | SPI 2 | MISO | GND | GND | MOSI | 1 | 2 | Analog | 3 | 4 | Z | B | 5 | 6 | A | 1 | 2 | 5V | Encoder | 3 | 4 | GND | 5 | 6 | Digital | 7 | 8 | DBG/EXT | GND | GND | YR 2020 | 3v3 | SWC | GND | SWD | RST | SWO | GP4 | GP3 | SCK3 | GP2 | 5V | RX | TX | GND | 3V3 | SCL | SDA | GP1 | Open FFBoard / USB interface V1.0 | MISO3
tDocu: JLCJLCJLCJLC